# EasyEDA Pro project SAM-2.eprj, board RelayPCB
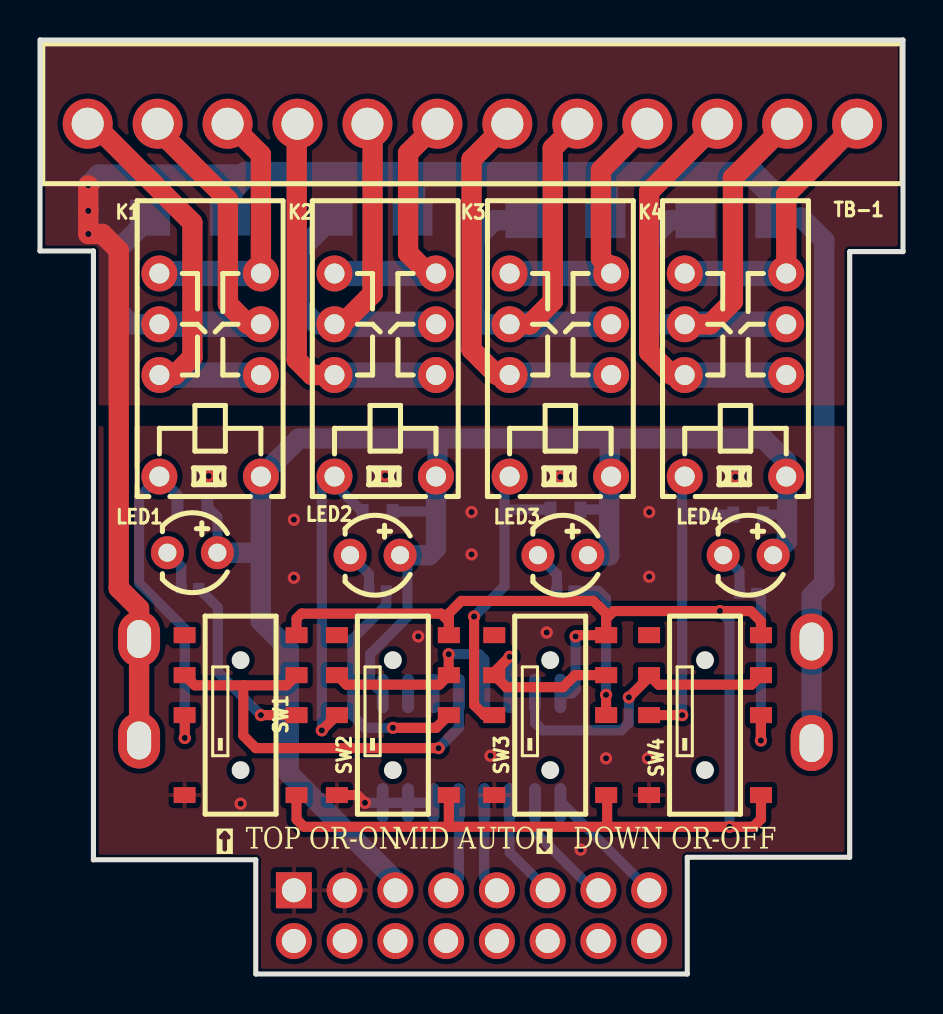
[diagram p22: board, top side]
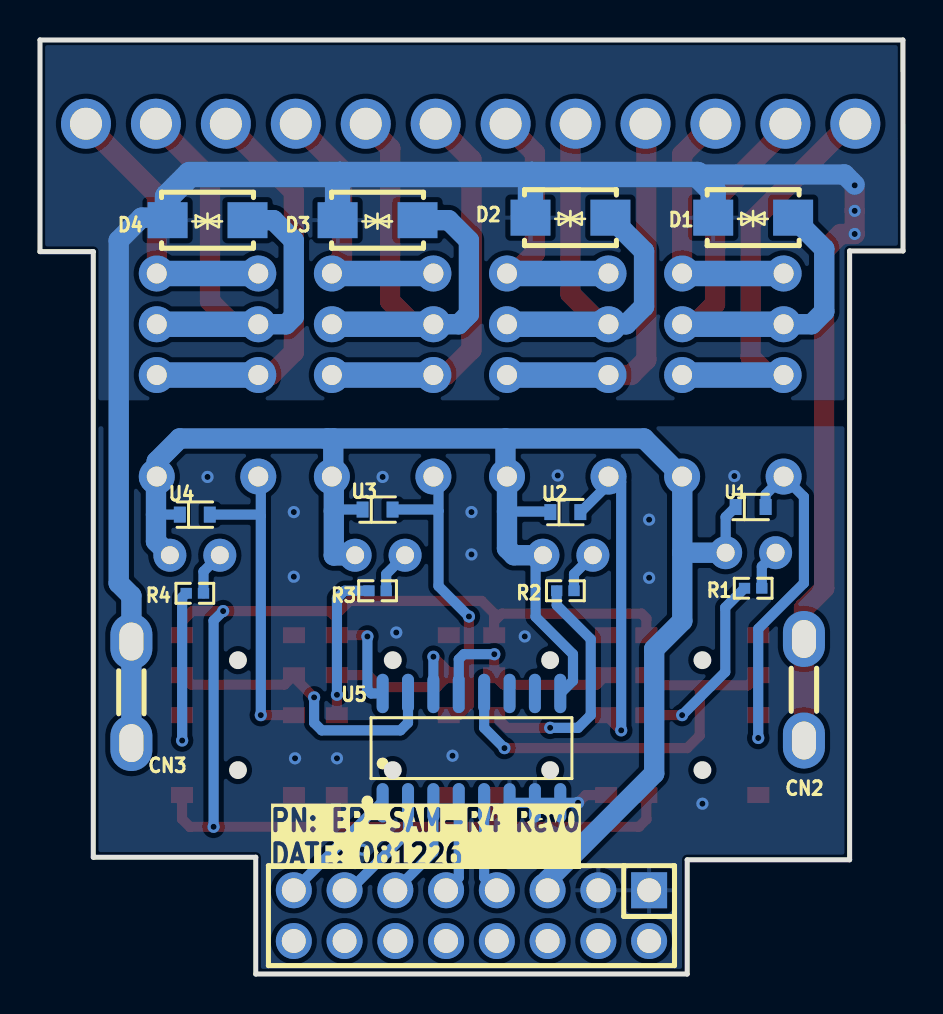
[diagram p23: board, bottom side, seen from below]

Outline 43.19 x 46.74 mm; copper layers: Top Layer, Bottom Layer. Coordinates in mm from the lower left corner of the outline.
Outline path: 0,36.18 2.67,36.18 2.67,5.71 10.8,5.71 10.8,0 32.39,0 32.39,5.84 40.52,5.84 40.52,36.15 43.19,36.15 43.19,46.74 0.01,46.74 0,36.18
Stack: Top Layer 0.035mm / Dielectric1 1.51mm FR4 er 4.5 / Bottom Layer 0.035mm

## Design rules (mm)
template: Custom Config
spacing copperThickness1oz (default): track to track 0.102, other pairs 0.152 to 0.3
spacing copperThickness2oz: track to track 0.203, other pairs 0.152 to 0.3
track width copperThickness1oz (default): min 0.127, default 0.254, max 2.54
track width copperThickness2oz: min 0.203, default 0.254, max 2.54
differential pair differentialPair (default): width min 0.127, default 0.254, max 2.54; gap min 0.152, default 0.152
via viaSize (default): diameter min 0.5, default 0.61, max 10; hole min 0.3, default 0.305, max 6.3

## Placement (name value [footprint] x y rotation side)
CN2  G480-08-2T  [TH-2_L6.4-W0.8-P5.08]  4.96 14.22 90 bottom
CN3  G480-08-2T  [TH-2_L6.4-W0.8-P5.08]  38.61 14.1 90 bottom
CN4  PZ254V-12-16P  [HDR-TH_16P-P2.54-V-M-R2-C8-S2.54]  21.6 2.92 0 bottom
D1  SMAJ60CA  [SMA_L4.4-W2.6-LS5.0-BI]  7.5 37.85 180 bottom
D2  SMAJ60CA  [SMA_L4.4-W2.6-LS5.0-BI]  16.64 37.85 180 bottom
D3  SMAJ60CA  [SMA_L4.4-W2.6-LS5.0-BI]  26.3 37.72 180 bottom
D4  SMAJ60CA  [SMA_L4.4-W2.6-LS5.0-BI]  34.8 37.72 180 bottom
K1  G6S-2 DC5  [RELAY-TH_G6S-2-X]  8.52 29.97 90 top
K2  G6S-2 DC5  [RELAY-TH_G6S-2-X]  17.28 29.97 90 top
K3  G6S-2 DC5  [RELAY-TH_G6S-2-X]  26.04 29.97 90 top
K4  G6S-2 DC5  [RELAY-TH_G6S-2-X]  34.8 29.97 90 top
LED1  204-10SDRD/S530-A3/F182-68  [LED-TH_BD4.0-P2.50-RD]  7.63 21.08 0 top
LED2  204-10SDRD/S530-A3/F182-68  [LED-TH_BD4.0-P2.50-RD]  16.77 20.95 0 top
LED3  204-10SDRD/S530-A3/F182-68  [LED-TH_BD4.0-P2.50-RD]  26.17 20.95 0 top
LED4  204-10SDRD/S530-A3/F182-68  [LED-TH_BD4.0-P2.50-RD]  35.44 20.95 0 top
R1  470Ω  [R0402]  7.5 19.3 180 bottom
R2  470Ω  [R0402]  16.9 19.18 180 bottom
R3  470Ω  [R0402]  26.3 19.18 180 bottom
R4  470Ω  [R0402]  35.44 19.05 180 bottom
SW1  MSS23C02G2-KC 125  [SW-SMD_MSS23C02G2-KC]  10.04 12.95 270 top
SW2  MSS23C02G2-KC 125  [SW-SMD_MSS23C02G2-KC]  17.66 12.95 270 top
SW3  MSS23C02G2-KC 125  [SW-SMD_MSS23C02G2-KC]  25.53 12.95 270 top
SW4  MSS23C02G2-KC 125  [SW-SMD_MSS23C02G2-KC]  33.28 12.95 270 top
TB-1  KF2EDGV-3.5-12P  [CONN-TH_12P-P3.50_KF2EDGV-3.5-12P]  21.64 42.54 180 top
U1  CDBU00340-HF  [SOD-523F_L1.7-W0.9-LS1.7-RD]  7.63 23.37 180 bottom
U2  CDBU00340-HF  [SOD-523F_L1.7-W0.9-LS1.7-RD]  16.9 23.11 180 bottom
U3  CDBU00340-HF  [SOD-523F_L1.7-W0.9-LS1.7-RD]  26.3 23.24 180 bottom
U4  CDBU00340-HF  [SOD-523F_L1.7-W0.9-LS1.7-RD]  35.44 22.99 180 bottom
U5  ULN2003ADR  [SOIC-16_L9.9-W3.9-P1.27-LS6.0-BL]  21.6 11.3 180 bottom

## Footprints (pads in the part's own frame, mm; a bottom-side part is the same pattern mirrored in y, then rotated)
CONN-TH_12P-P3.50_KF2EDGV-3.5-12P
  round 2.5 hole 1.6: 1(-19.25,0) 2(-15.75,0) 3(-12.25,0) 4(-8.75,0) 5(-5.25,0) 6(-1.75,0) 7(1.75,0) 8(5.25,0) 9(8.75,0) 10(12.25,0) 11(15.75,0) 12(19.25,0)
HDR-TH_16P-P2.54-V-M-R2-C8-S2.54
  rect 1.8x1.8 hole 1.2: 1(-8.89,-1.27)
  round 1.8 hole 1.2: 2(-8.89,1.27) 3(-6.35,-1.27) 4(-6.35,1.27) 5(-3.81,-1.27) 6(-3.81,1.27) 7(-1.27,-1.27) 8(-1.27,1.27) 9(1.27,-1.27) 10(1.27,1.27) 11(3.81,-1.27) 12(3.81,1.27) 13(6.35,-1.27) 14(6.35,1.27) 15(8.89,-1.27) 16(8.89,1.27)
LED-TH_BD4.0-P2.50-RD
  round 1.651 hole 0.9: 1(-1.25,0) 2(1.25,0)
R0402
  rect 0.566x0.54 smd: 1(-0.433,0) 2(0.433,0)
RELAY-TH_G6S-2-X
  round 1.8 hole 1: 1(-5.08,-2.54) 3(0,-2.54) 4(2.54,-2.54) 5(5.08,-2.54) 8(5.08,2.54) 9(2.54,2.54) 10(0,2.54) 12(-5.08,2.54)
SMA_L4.4-W2.6-LS5.0-BI
  rect 2x1.8 smd: 1(-2,0) 2(2,0)
SOD-523F_L1.7-W0.9-LS1.7-RD
  rect 0.6x0.8 smd: 1(-0.75,0) 2(0.75,0)
SOIC-16_L9.9-W3.9-P1.27-LS6.0-BL
  oval 0.602x1.971 smd: 1(-4.445,-2.736) 2(-3.175,-2.736) 3(-1.905,-2.736) 4(-0.635,-2.736) 5(0.635,-2.736) 6(1.905,-2.736) 7(3.175,-2.736) 8(4.445,-2.736) 9(4.445,2.736) 10(3.175,2.736) 11(1.905,2.736) 12(0.635,2.736) 13(-0.635,2.736) 14(-1.905,2.736) 15(-3.175,2.736) 16(-4.445,2.736)
SW-SMD_MSS23C02G2-KC
  rect 0.8x1.1 smd: 1(-4,-2.8) 2(-2,-2.8) 3(0,-2.8) 4(4,-2.8) 5(4,2.8) 6(0,2.8) 7(-2,2.8) 8(-4,2.8)
TH-2_L6.4-W0.8-P5.08
  oval 2.8x2.1 hole 1.9x1.2: 1(-2.54,0) 2(2.54,0)

## Nets
5V0: CN4.5 K1.1 K2.1 K3.1 K4.1 LED1.2 LED2.2 LED3.2 LED4.2 U1.1 U2.1 U3.1 U4.1 U5.9
BB_BLINK: CN4.15 U5.1
BB_RL_P1: CN4.7 U5.5
BB_RL_P2: CN4.9 U5.4
BB_RL_P3: CN4.11 U5.3
BB_RL_P4: CN4.13 U5.2
BLINK: SW1.5 SW1.8 SW2.5 SW2.8 SW3.5 SW3.8 SW4.5 SW4.8 U5.16
COM: CN4.1 CN4.3 SW1.4 SW2.4 SW3.4 SW4.4 U5.6 U5.7 U5.8
EARTH_COM: CN2.1 CN2.2 CN3.1 CN3.2 D1.1 D2.1 D3.1 D4.1
K1: SW1.2 SW1.7 U5.12
K2: SW2.2 SW2.7 U5.13
K3: SW3.2 SW3.7 U5.14
K4: SW4.2 SW4.7 U5.15
RL_COM1: D1.2 K1.4 K1.9 TB-1.11
RL_COM2: D2.2 K2.4 K2.9 TB-1.8
RL_COM3: D3.2 K3.4 K3.9 TB-1.5
RL_COM4: D4.2 K4.4 K4.9 TB-1.2
RL_N1: K1.12 SW1.3 U1.2
RL_N2: K2.12 SW2.3 U2.2
RL_N3: K3.12 SW3.3 U3.2
RL_N4: K4.12 SW4.3 U4.2
RL_NC1: K1.3 K1.10 TB-1.12
RL_NC2: K2.3 K2.10 TB-1.9
RL_NC3: K3.3 K3.10 TB-1.6
RL_NC4: K4.3 K4.10 TB-1.3
RL_NO1: K1.5 K1.8 TB-1.10
RL_NO2: K2.5 K2.8 TB-1.7
RL_NO3: K3.5 K3.8 TB-1.4
RL_NO4: K4.5 K4.8 TB-1.1
$1N2148: R1.1 SW1.6
$1N2154: LED1.1 R1.2
$1N6187: R2.1 SW2.6
$1N6188: LED2.1 R2.2
$1N6409: R3.1 SW3.6
$1N6410: LED3.1 R3.2
$1N6631: R4.1 SW4.6
$1N6632: LED4.1 R4.2

Pads without a net: CN4 2 4 6 8 10 12 14 16; SW1 1; SW2 1; SW3 1; SW4 1; U5 10 11

## Via types
v1: diameter 0.61, hole 0.305, Top Layer to Bottom Layer, 36 vias

## Routing (per net, layer and track width the routed paths; a pad name or vN(x,y) marks a point on that pad's centre or on a via; arc(x,y) is an arc through that point)
5V0: length 88.3
  Bottom Layer w0.508: U5.9 16.52,14.67 16.52,16 18.39,17.87 18.39,20.59 LED2.2 ; 19.82,23.14 17.67,23.14 U2.1 ; 28.7,24.89 28.84,24.89 ; U1.1 8.88,22.87 LED1.2 ; 28.48,23.18 28.43,23.24 U3.1 ; 37.85,24.65 37.98,24.78 ; U4.1 37.38,22.99
  Bottom Layer w1.016: 11.05,21.08 LED1.2 ; 11.05,21.08 11.05,24.88 K1.1 12.96,26.8 19.9,26.8 ; 11.05,21.08 11.05,17.66 12.45,16.26 12.45,10.03 17.79,4.7 CN4.5 ; 37.38,24.85 37.38,21.65 LED4.2 ; 28.51,26.8 28.51,24.96 K3.1 ; 28.51,26.8 28.79,26.8 ; 28.51,26.8 19.9,26.8 ; 19.9,26.8 19.9,24.97 K2.1 19.82,21.3 19.47,20.95 LED2.2 ; K4.1 37.34,25.65 36.2,26.8 28.79,26.8 ; 28.79,26.8 28.84,26.75 ; 28.48,24.8 28.48,20.94 27.43,20.94 LED3.2
BB_BLINK: length 6.3
  Bottom Layer w0.508: U5.1 26.11,8.57 CN4.15
BB_RL_P1: length 4.6
  Bottom Layer w0.508: U5.5 20.96,4.83 CN4.7
BB_RL_P2: length 4.6
  Bottom Layer w0.508: U5.4 22.23,4.83 CN4.9
BB_RL_P3: length 5.2
  Bottom Layer w0.508: U5.3 23.5,6.1 CN4.11
BB_RL_P4: length 5.8
  Bottom Layer w0.508: CN4.13 27.69,4.19 24.77,7.11 U5.2
BLINK: length 73.3
  Top Layer w0.508: 28.33,17.79 SW3.8 26.87,16.95 v1(26.8,16.89) ; 28.33,17.79 28.33,18.03 27.69,18.67 21.09,18.67 20.46,18.04 20.46,17.65 ; 28.33,17.79 28.71,18.16 v1(34.02,18.16) 35.57,18.16 36.08,17.65 SW4.8 ; SW4.5 36.08,7.75 35.69,7.37 v1(34.5,7.37) 28.38,7.37 ; SW1.8 12.84,17.79 13.09,18.03 20.07,18.03 20.46,17.65 ; 20.49,7.37 13.21,7.37 12.84,7.74 SW1.5 ; 20.49,7.37 28.38,7.37 ; 20.49,7.37 20.46,7.4 SW2.5 ; 20.46,17.65 SW2.8 ; 28.38,7.37 28.38,8.91 SW3.5
  Bottom Layer w0.508: U5.16 26.62,14.04 26.8,14.22 v1(26.8,16.89) ; v1(34.5,7.37) 34.5,17.68 v1(34.02,18.16)
COM: length 5
  Top Layer w0.508: SW2.4 15.88,8.95 v1(16.26,8.57)
  Bottom Layer w0.508: U5.6 U5.7 U5.8 v1(16.26,8.57)
  vias: v1(8.44,24.92) v1(10.04,8.52) v1(12.71,22.73) v1(12.71,19.83) v1(17.28,24.94) v1(18.93,16.89) v1(21.6,23.11) v1(21.6,21) v1(22.54,10.92) v1(25.36,17.09) v1(26.04,24.87) v1(27.06,6.22) v1(28.33,10.79) v1(30.49,23.11) v1(30.49,19.88) v1(30.42,10.79) v1(34.8,24.87)
EARTH_COM: length 100.9
  Top Layer w1.016: CN2.1 CN2.2 4.96,18.29 3.94,19.3 3.94,36.21 3.12,37.03 v1(2.42,37.03) v1(2.42,38.19) v1(2.42,39.46)
  Bottom Layer w1.016: 2.42,39.5 2.93,40 10.29,40 ; D4.1 36.93,37.85 38.11,37.85 39.25,36.7 39.25,19.56 38.61,18.92 CN3.2 CN3.1
  Bottom Layer w1.27: 18.58,40 10.29,40 9.5,39.21 D1.1 ; 18.58,40 28.18,40 ; 18.58,40 18.64,39.94 D2.1 ; 28.18,40 35.69,40 36.8,38.89 D4.1 ; 28.18,40 28.3,39.89 D3.1
K1: length 21.7
  Top Layer w0.508: SW1.7 12.33,14.45 10.17,14.45 ; SW1.2 7.75,14.45 10.17,14.45 ; 10.17,14.45 10.17,11.93 10.8,11.3 v1(19.95,11.3)
  Bottom Layer w0.508: v1(19.95,11.3) 20.96,12.32 U5.12
K2: length 10.6
  Top Layer w0.508: v1(20.45,16) 20.45,14.96 SW2.7 19.98,14.48 15.34,14.48 SW2.2
  Bottom Layer w0.508: v1(20.45,16) 21.98,16 22.23,15.75 U5.13
K3: length 9.2
  Top Layer w0.508: SW3.7 26.77,14.95 26.17,14.35 23.34,14.35 SW3.2 22.73,15.11 v1(23.5,15.87)
  Bottom Layer w0.508: U5.14 v1(23.5,15.87)
K4: length 15.3
  Top Layer w0.508: v1(29.47,13.84) 30.48,14.85 SW4.2 30.96,14.48 35.6,14.48 SW4.7
  Bottom Layer w0.508: v1(29.47,13.84) 29.47,12.57 29.09,12.19 25.15,12.19 24.77,12.57 U5.15
RL_COM1: length 25.2
  Top Layer w1.016: K1.4 10.42,32.51 9.4,33.53 9.4,38.73 6.02,42.12 6.02,42.54
  Bottom Layer w1.016: D1.2 3.94,36.29 3.94,33.15 4.58,32.51 K1.9
  Bottom Layer w1.27: K1.9 K1.4
RL_COM2: length 23.9
  Top Layer w1.016: TB-1.8 16.64,42.29 16.64,34.04 15.12,32.51 14.36,32.51
  Bottom Layer w1.016: D2.2 12.96,36.16 12.96,33.4 13.85,32.51 K2.9
  Bottom Layer w1.27: K2.9 K2.4
RL_COM3: length 25.5
  Top Layer w1.016: TB-1.5 25.66,41.32 25.66,33.65 24.52,32.51 23.76,32.51
  Bottom Layer w1.016: K3.9 22.23,32.51 21.72,33.02 21.72,36.7 22.74,37.72 D3.2
  Bottom Layer w1.27: K3.9 K3.4
RL_COM4: length 26.5
  Top Layer w1.016: TB-1.2 34.68,39.83 34.68,33.65 33.53,32.51 K4.9
  Bottom Layer w1.016: K4.9 30.87,32.51 30.49,32.89 30.49,36.7 31.5,37.72 D4.2
  Bottom Layer w1.27: K4.9 K4.4
RL_N1: length 17.5
  Top Layer w0.508: SW1.3 7.25,12.95 v1(7.25,11.81)
  Bottom Layer w0.508: v1(7.25,11.81) 7.25,17.27 4.96,19.56 4.96,23.88 K1.12 6.88,23.99 U1.2
RL_N2: length 16.4
  Top Layer w0.508: SW2.3 14.86,12.95 v1(14.1,12.19)
  Bottom Layer w0.508: U2.2 16.14,23.11 14.36,24.89 14.1,24.64 v1(14.1,12.19)
RL_N3: length 15.7
  Top Layer w0.508: SW3.3 22.23,12.95 21.72,13.46 v1(21.72,17.89)
  Bottom Layer w0.508: K3.12 23.25,24.64 23.25,23.17 ; v1(21.72,17.89) 23.25,19.41 23.25,23.17 ; U3.2 23.32,23.24 23.25,23.17
RL_N4: length 16.2
  Top Layer w0.508: SW4.3 v1(32.14,12.95)
  Bottom Layer w0.508: 32.14,22.92 32.14,24.76 K4.12 ; 32.14,22.92 v1(32.14,12.95) ; 32.14,22.92 32.21,22.99 U4.2
RL_NC1: length 21
  Top Layer w1.016: 2.52,42.54 2.67,42.54 7.63,37.59 7.63,30.86 6.74,29.97 K1.10
  Bottom Layer w1.27: K1.10 K1.3
RL_NC2: length 18.8
  Top Layer w1.016: 14.36,29.97 13.61,29.97 12.85,30.73 12.85,42.38 13.01,42.54
  Bottom Layer w1.27: K2.10 K2.3
RL_NC3: length 19.8
  Top Layer w1.016: TB-1.6 21.6,40.75 21.6,31.24 22.87,29.97 23.76,29.97
  Bottom Layer w1.27: K3.10 K3.3
RL_NC4: length 20.2
  Top Layer w1.016: K4.10 31.63,29.97 30.49,31.11 30.49,39.14 TB-1.3
  Bottom Layer w1.27: K4.10 K4.3
RL_NO1: length 13.2
  Top Layer w1.016: 9.52,42.54 11.06,41 K1.5
  Bottom Layer w1.27: K1.8 K1.5
RL_NO2: length 13.6
  Top Layer w1.016: TB-1.7 18.42,41.08 18.42,36.07 19.44,35.05
  Bottom Layer w1.27: K2.8 K2.5
RL_NO3: length 13.7
  Top Layer w1.016: K3.5 28.58,35.31 28.07,35.81 28.07,40.23 TB-1.4
  Bottom Layer w1.27: K3.8 K3.5
RL_NO4: length 14
  Top Layer w1.016: TB-1.1 37.34,39 K4.5
  Bottom Layer w1.27: K4.8 K4.5
$1N2148: length 9.4
  Top Layer w0.508: SW1.6 v1(11.06,12.95)
  Bottom Layer w0.508: v1(11.06,12.95) 8.9,15.11 8.9,18.34 R1.1
$1N2154: length 2.1
  Bottom Layer w0.508: LED1.1 7.07,20.39 R1.2
$1N6187: length 12.3
  Top Layer w0.508: SW2.6 19.82,12.32 v1(17.66,12.32)
  Bottom Layer w0.508: v1(17.66,12.32) 16.26,12.32 15.63,12.95 15.63,16.76 17.33,18.46 R2.1
$1N6188: length 2.2
  Bottom Layer w0.508: LED2.1 16.46,20.01 16.46,19.18
$1N6409: length 7.6
  Top Layer w0.508: SW3.6 28.33,12.96 v1(28.33,13.97)
  Bottom Layer w0.508: v1(28.33,13.97) 28.33,18.8 27.95,19.18 R3.1
$1N6410: length 2.2
  Bottom Layer w0.508: LED3.1 25.86,20.01 R3.2
$1N6631: length 8.7
  Top Layer w0.508: v1(36.07,11.68) 36.07,12.95 SW4.6
  Bottom Layer w0.508: R4.1 36.07,18.85 v1(36.07,11.68)
$1N6632: length 2.2
  Bottom Layer w0.508: R4.2 35.01,20.14 LED4.1

## Copper pours and planes (outline as drawn; the poured copper is in the pictures)
COM on Top Layer: 2.67,27.43 40.39,27.43 40.39,0 2.67,0
COM on Bottom Layer: 2.67,27.41 40.52,27.41 40.52,-0.13 2.67,-0.13
EARTH_COM on Top Layer: -0.25,46.86 43.44,46.86 43.44,28.45 -0.25,28.45
EARTH_COM on Bottom Layer: -1.26,47.37 43.45,47.37 43.45,28.7 -1.26,28.7

## Text on the board
Bottom Silkscreen Layer: PN: EP-SAM-R4 Rev0 / DATE: 081226
Top Silkscreen Layer: ↑ | TOP OR-ON | MID AUTO | ↓ | DOWN OR-OFF
